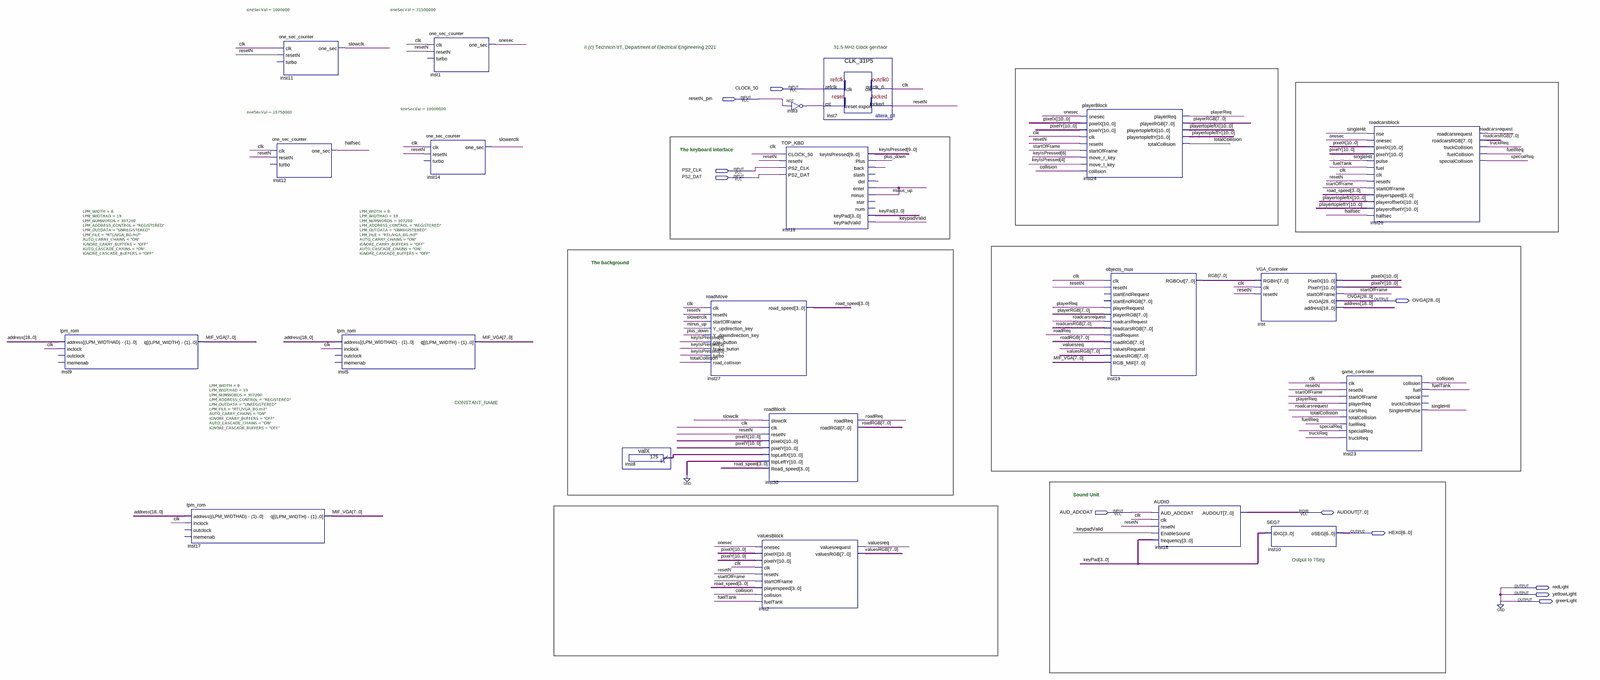
[diagram p0: schematic sheet, whole]
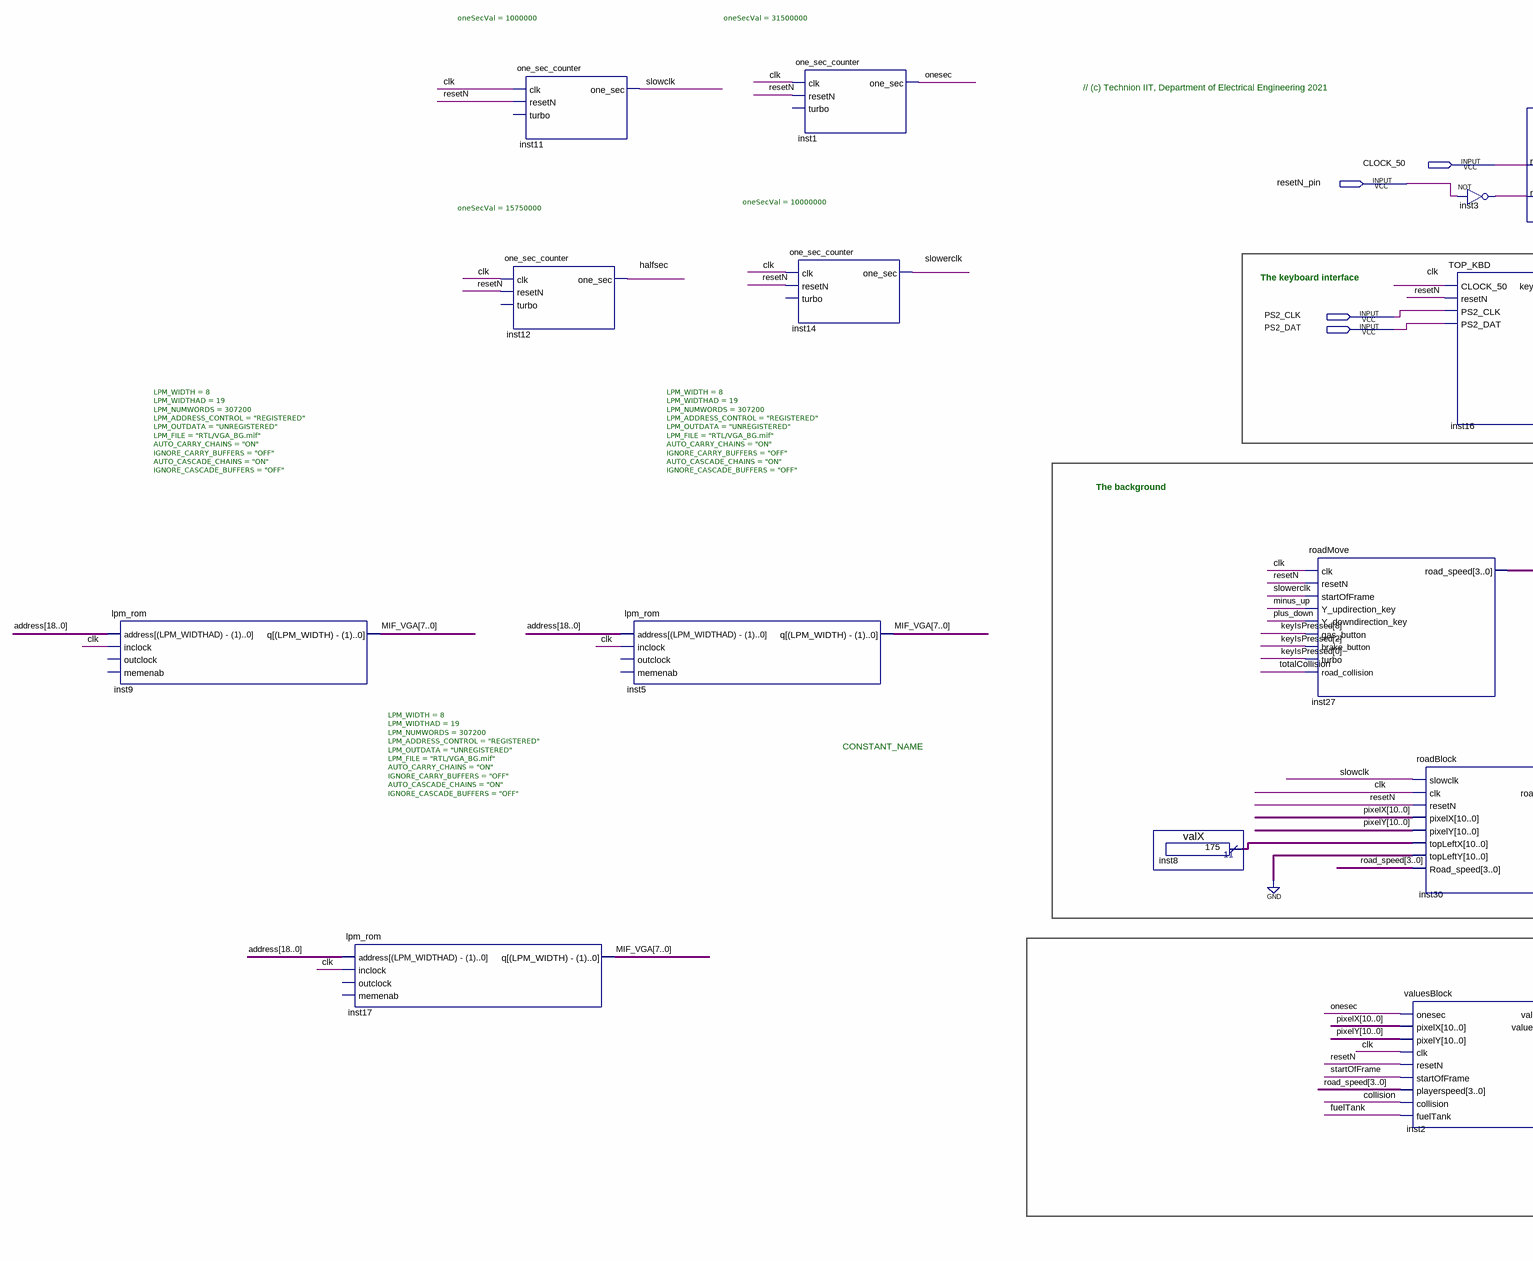
[diagram p1: schematic sheet, left part]
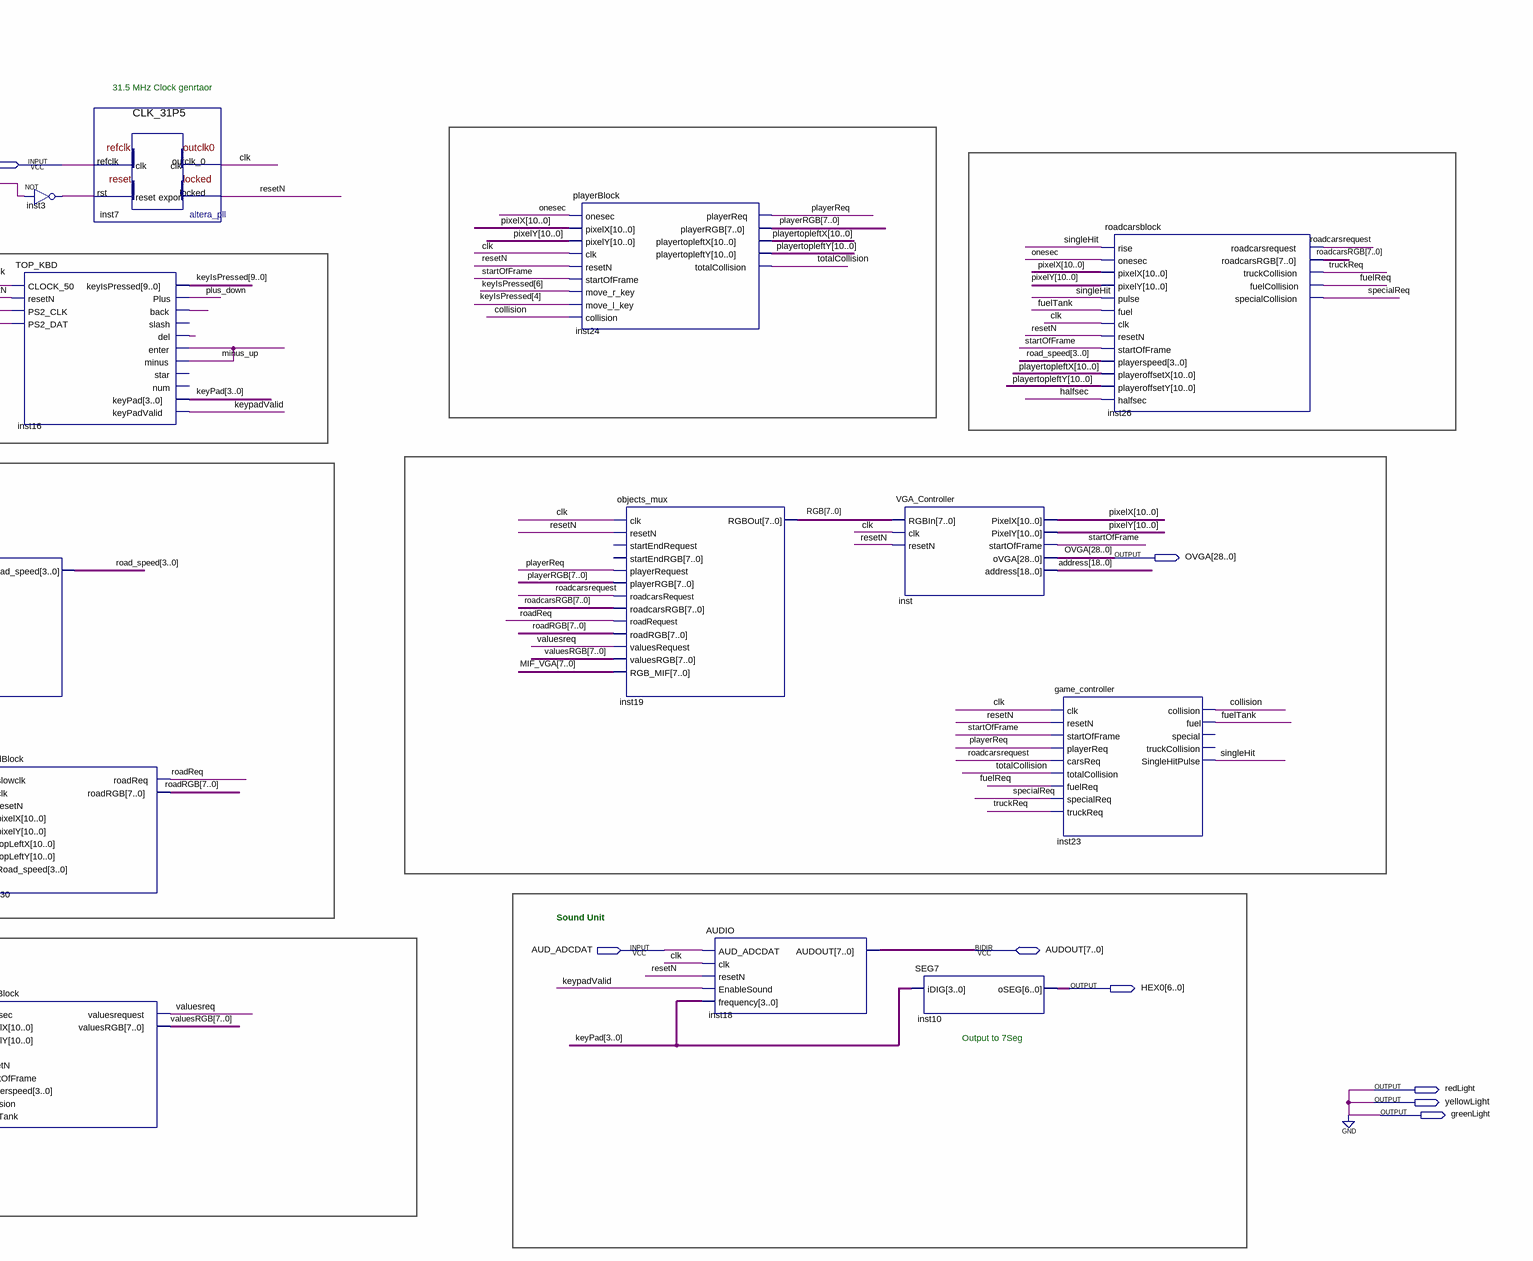
[diagram p2: schematic sheet, right part]
// Quartus schematic TOP_VGA.bdf as structural Verilog: 21 symbols, 11 pins
module TOP_VGA (
  input  CLOCK_50,
  input  resetN_pin,
  input  PS2_CLK,
  input  PS2_DAT,
  input  AUD_ADCDAT,
  inout  [7:0] AUDOUT,
  output [28:0] OVGA,
  output [6:0] HEX0,
  output redLight,
  output yellowLight,
  output greenLight
);

  wire clk, collision, fuelReq, fuelTank, halfsec, inst3_out, inst16_back, inst16_del, keypadValid, minus_up,
       onesec, playerReq, plus_down, resetN, roadcarsrequest, roadReq, singleHit, slowclk, slowerclk,
       specialReq, startOfFrame, totalCollision, truckReq, valuesreq;
  wire [3:0] keyPad, road_speed;
  wire [7:0] MIF_VGA, playerRGB, RGB, roadcarsRGB, roadRGB, valuesRGB;
  wire [9:0] keyIsPressed;
  wire [10:0] inst8_result, pixelX, pixelY, playertopleftX, playertopleftY;
  wire [18:0] address;

  lpm_rom #(.LPM_WIDTH(8), .LPM_WIDTHAD(19), .LPM_NUMWORDS(307200), .LPM_ADDRESS_CONTROL("REGISTERED"), .LPM_OUTDATA("UNREGISTERED"), .LPM_FILE("RTL/VGA_BG.mif"), .AUTO_CARRY_CHAINS("ON"), .IGNORE_CARRY_BUFFERS("OFF"), .AUTO_CASCADE_CHAINS("ON"), .IGNORE_CASCADE_BUFFERS("OFF")) inst9 (
    .address(address), .inclock(clk), .q(MIF_VGA));  // open: outclock, memenab
  lpm_rom #(.LPM_WIDTH(8), .LPM_WIDTHAD(19), .LPM_NUMWORDS(307200), .LPM_ADDRESS_CONTROL("REGISTERED"), .LPM_OUTDATA("UNREGISTERED"), .LPM_FILE("RTL/VGA_BG.mif"), .AUTO_CARRY_CHAINS("ON"), .IGNORE_CARRY_BUFFERS("OFF"), .AUTO_CASCADE_CHAINS("ON"), .IGNORE_CASCADE_BUFFERS("OFF")) inst17 (
    .address(address), .inclock(clk), .q(MIF_VGA));  // open: outclock, memenab
  one_sec_counter #(.oneSecVal(1000000)) inst11 (.clk(clk), .resetN(resetN), .one_sec(slowclk));  // open: turbo
  one_sec_counter #(.oneSecVal(15750000)) inst12 (.clk(clk), .resetN(resetN), .one_sec(halfsec));  // open: turbo
  lpm_rom #(.LPM_WIDTH(8), .LPM_WIDTHAD(19), .LPM_NUMWORDS(307200), .LPM_ADDRESS_CONTROL("REGISTERED"), .LPM_OUTDATA("UNREGISTERED"), .LPM_FILE("RTL/VGA_BG.mif"), .AUTO_CARRY_CHAINS("ON"), .IGNORE_CARRY_BUFFERS("OFF"), .AUTO_CASCADE_CHAINS("ON"), .IGNORE_CASCADE_BUFFERS("OFF")) inst5 (
    .address(address), .inclock(clk), .q(MIF_VGA));  // open: outclock, memenab
  one_sec_counter #(.oneSecVal(31500000)) inst1 (.clk(clk), .resetN(resetN), .one_sec(onesec));  // open: turbo
  one_sec_counter #(.oneSecVal(10000000)) inst14 (.clk(clk), .resetN(resetN), .one_sec(slowerclk));  // open: turbo
  valX inst8 (.result(inst8_result));
  roadMove inst27 (
    .clk(clk), .resetN(resetN), .startOfFrame(slowerclk), .Y_updirection_key(minus_up),
    .Y_downdirection_key(plus_down), .gas_button(keyIsPressed[8]), .brake_button(keyIsPressed[2]),
    .turbo(keyIsPressed[0]), .road_collision(totalCollision), .road_speed(road_speed));
  roadBlock inst30 (
    .slowclk(slowclk), .clk(clk), .resetN(resetN), .pixelX(pixelX), .pixelY(pixelY), .topLeftX(inst8_result),
    .topLeftY({11{1'b0}}), .Road_speed(road_speed), .roadReq(roadReq), .roadRGB(roadRGB));
  valuesBlock inst2 (
    .onesec(onesec), .pixelX(pixelX), .pixelY(pixelY), .clk(clk), .resetN(resetN),
    .startOfFrame(startOfFrame), .playerspeed(road_speed), .collision(collision), .fuelTank(fuelTank),
    .valuesrequest(valuesreq), .valuesRGB(valuesRGB));
  not inst3 (inst3_out, resetN_pin);
  TOP_KBD inst16 (
    .CLOCK_50(clk), .resetN(resetN), .PS2_CLK(PS2_CLK), .PS2_DAT(PS2_DAT), .keyIsPressed(keyIsPressed),
    .Plus(plus_down), .back(inst16_back), .del(inst16_del), .enter(minus_up), .minus(minus_up),
    .keyPad(keyPad), .keyPadValid(keypadValid));  // open: slash, star, num
  CLK_31P5 inst7 (.refclk(CLOCK_50), .rst(inst3_out), .outclk_0(clk), .locked(resetN));
  playerBlock inst24 (
    .onesec(onesec), .pixelX(pixelX), .pixelY(pixelY), .clk(clk), .resetN(resetN),
    .startOfFrame(startOfFrame), .move_r_key(keyIsPressed[6]), .move_l_key(keyIsPressed[4]),
    .collision(collision), .playerReq(playerReq), .playerRGB(playerRGB), .playertopleftX(playertopleftX),
    .playertopleftY(playertopleftY), .totalCollision(totalCollision));
  objects_mux inst19 (
    .clk(clk), .resetN(resetN), .playerRequest(playerReq), .playerRGB(playerRGB),
    .roadcarsRequest(roadcarsrequest), .roadcarsRGB(roadcarsRGB), .roadRequest(roadReq), .roadRGB(roadRGB),
    .valuesRequest(valuesreq), .valuesRGB(valuesRGB), .RGB_MIF(MIF_VGA), .RGBOut(RGB));  // open: startEndRequest, startEndRGB
  AUDIO inst18 (
    .AUD_ADCDAT(AUD_ADCDAT), .clk(clk), .resetN(resetN), .EnableSound(keypadValid), .frequency(keyPad),
    .AUDOUT(AUDOUT));
  VGA_Controller inst (
    .RGBIn(RGB), .clk(clk), .resetN(resetN), .PixelX(pixelX), .PixelY(pixelY), .startOfFrame(startOfFrame),
    .oVGA(OVGA), .address(address));
  SEG7 inst10 (.iDIG(keyPad), .oSEG(HEX0));
  game_controller inst23 (
    .clk(clk), .resetN(resetN), .startOfFrame(startOfFrame), .playerReq(playerReq),
    .carsReq(roadcarsrequest), .totalCollision(totalCollision), .fuelReq(fuelReq), .specialReq(specialReq),
    .truckReq(truckReq), .collision(collision), .fuel(fuelTank), .SingleHitPulse(singleHit));  // open: special, truckCollision
  roadcarsblock inst26 (
    .rise(singleHit), .onesec(onesec), .pixelX(pixelX), .pixelY(pixelY), .pulse(singleHit), .fuel(fuelTank),
    .clk(clk), .resetN(resetN), .startOfFrame(startOfFrame), .playerspeed(road_speed),
    .playeroffsetX(playertopleftX), .playeroffsetY(playertopleftY), .halfsec(halfsec),
    .roadcarsrequest(roadcarsrequest), .roadcarsRGB(roadcarsRGB), .truckCollision(truckReq),
    .fuelCollision(fuelReq), .specialCollision(specialReq));

  assign greenLight = 1'b0;
  assign redLight = 1'b0;
  assign yellowLight = 1'b0;

  // Notes on the sheet:
  //   // (c) Technion IIT, Department of Electrical Engineering 2021
  //   31.5 MHz Clock genrtaor
  //   The keyboard interface
  //   The background
  //   CONSTANT_NAME
  //   Sound Unit
  //   Output to 7Seg
endmodule
